# Altium schematic sheet Peripherals_2.SchDoc: PCB_Personal_Gif
size A4; DrawnBy: Ravi kumar dusi; SheetNumber: 3; SheetTotal: 4
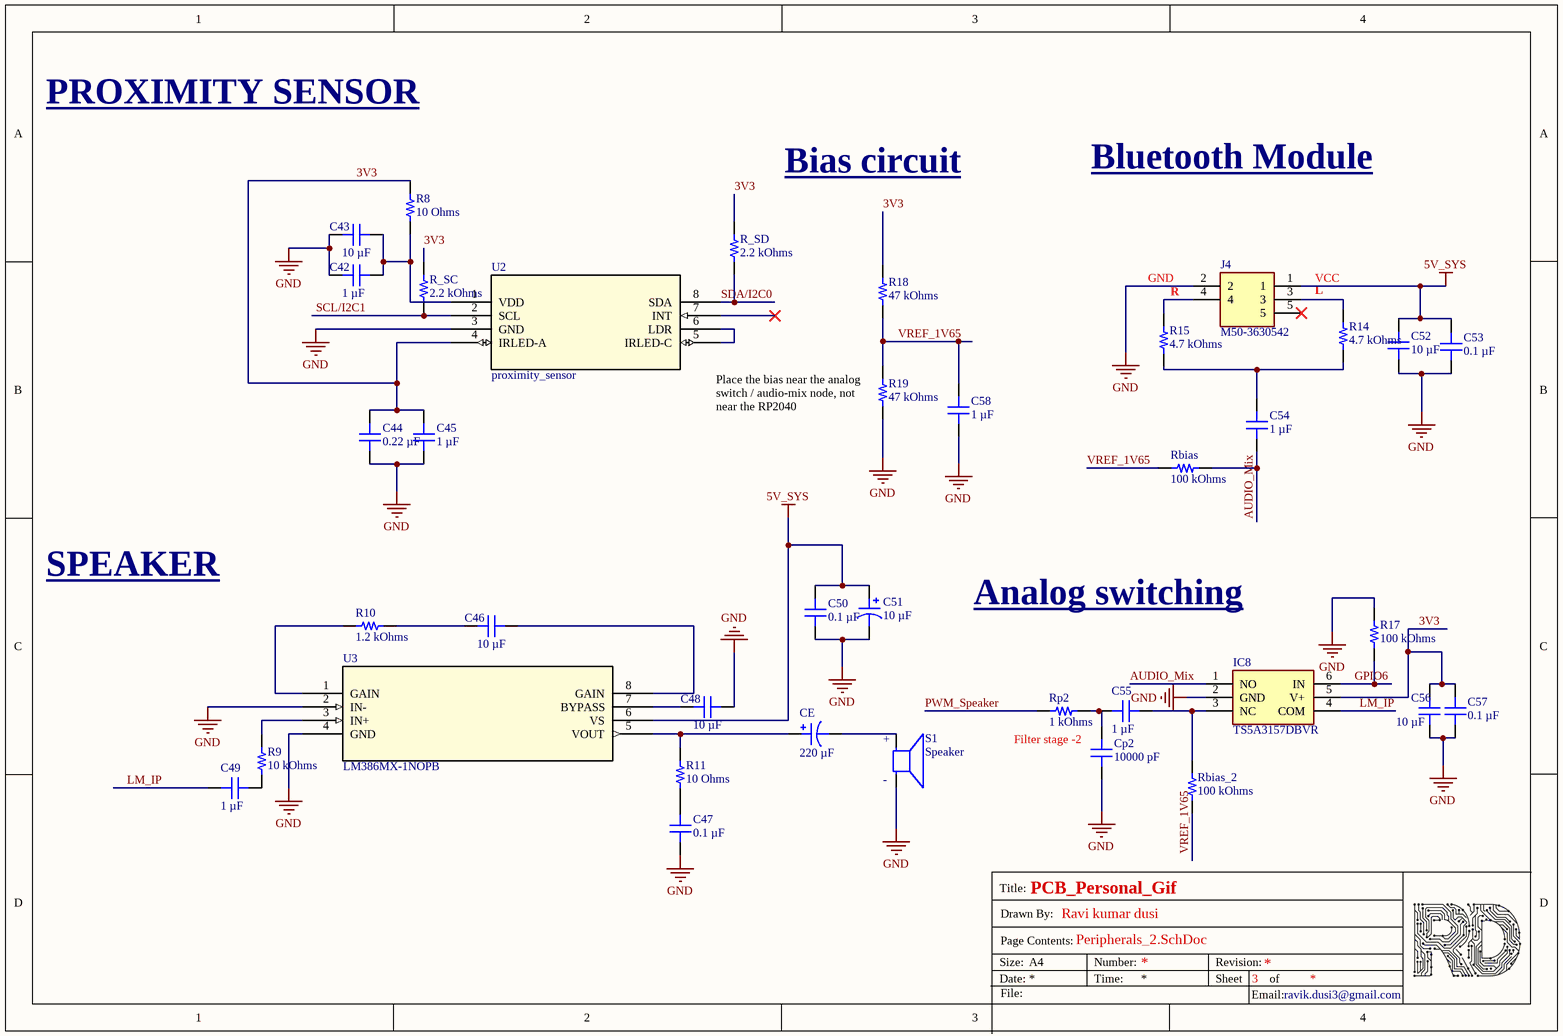
[diagram p0: Peripherals_2.SchDoc]

## Parts
C42  1 µF  [CAP 0402_1005]
C43  10 µF  [CAP 0402_1005]
C44  0.22 µF  [CAP 0402_1005]
C45  1 µF  [CAP 0402_1005]
C46  10 µF  [CAP 0402_1005]
C47  0.1 µF  [CAP 0402_1005]
C48  10 µF  [CAP 0402_1005]
C49  1 µF  [MURATA GRM155 0402_1005]
C50  0.1 µF  [CAP 0402_1005]
C51  10 µF  [CAP ALSMD 4.3MM H5.4MM]
C52  10 µF  [CAP 0402_1005]
C53  0.1 µF  [CAP 0402_1005]
C54  1 µF  [MURATA GRM155 0402_1005]
C55  1 µF  [MURATA GRM155 0402_1005]
C56  10 µF  [CAP 0402_1005]
C57  0.1 µF  [CAP 0402_1005]
C58  1 µF  [MURATA GRM155 0402_1005]
CE  220 µF  [CAP ALSMD 8.3MM H10.5MM]
Cp2  10000 pF  [CAP 0402_1005]
IC8  TS5A3157DBVR  [SOT95P280X145-6N]
J4  M50-3630542  [M503630542]
R8  10 Ohms  [RES 0402_1005]
R9  10 kOhms  [RES 0402_1005]
R10  1.2 kOhms  [RES 0402_1005]
R11  10 Ohms  [RES 0402_1005]
R14  4.7 kOhms  [YAGEO RES 0402_1005]
R15  4.7 kOhms  [YAGEO RES 0402_1005]
R17  100 kOhms  [RES 0402_1005]
R18  47 kOhms  [YAGEO RES 0402_1005]
R19  47 kOhms  [YAGEO RES 0402_1005]
R_SC  2.2 kOhms  [RES 0402_1005]
R_SD  2.2 kOhms  [RES 0402_1005]
Rbias  100 kOhms  [RES 0402_1005]
Rbias_2  100 kOhms  [RES 0402_1005]
Rp2  1 kOhms  [YAGEO RES 0402_1005]
S1  Speaker  [SPKR_AS01508MS-SC11-WP-R]
U2  proximity_sensor  [SMT_X01-GS08_VIS]
U3  LM386MX-1NOPB  [M08A_TEX]

## Nets
5V_SYS: C50.2 C51.1 C52.2 C53.2 J4.1 U3.6(VS)
GND: C42.2 C43.1 C44.1 C45.2 C47.1 C48.2 C50.1 C51.2 C52.1 C53.1 C56.1 C57.1 C58.1 Cp2.1 IC8.2(GND) J4.2 R17.2 R19.1 S1.N(NEG) U2.3(GND) U3.2(IN-) U3.4(GND)
3V3: C44.2 C45.1 C56.2 C57.2 IC8.5(V+) R8.2 R18.2 R_SC.2 R_SD.2 U2.4(IRLED-A)
AUDIO_Mix: C54.1 IC8.1(NO) Rbias.2
GPIO6: IC8.6(IN) R17.1
LM_IP: C49.1 IC8.4(COM)
PWM_Speaker: Rp2.1
SCL/I2C1: R_SC.1 U2.2(SCL)
SDA/I2C0: R_SD.1 U2.8(SDA)
VREF_1V65: C58.2 R18.1 R19.2 Rbias.1 Rbias_2.1
NetC42_1: C42.1 C43.2 R8.1 U2.1(VDD)
NetC46_1: C46.1 R10.2
NetC46_2: C46.2 U3.8(GAIN)
NetC47_2: C47.2 R11.1
NetC48_1: C48.1 U3.7(BYPASS)
NetC49_2: C49.2 R9.1
NetC54_2: C54.2 R14.1 R15.1
NetC55_1: C55.1 Cp2.2 Rp2.2
NetC55_2: C55.2 IC8.3(NC) Rbias_2.2
NetCE_1: CE.1 R11.2 U3.5(VOUT)
NetCE_2: CE.2 S1.P(POS)
NetJ4_3: J4.3 R14.2
NetJ4_4: J4.4 R15.2
NetR9_2: R9.2 U3.3(IN+)
NetR10_1: R10.1 U3.1(GAIN)
NetU2_5: U2.5(IRLED-C) U2.6(LDR)

Not connected (* = marked no-connect by the designer): J4 5*; U2 7(INT)*

## Notes on the sheet
- PROXIMITY SENSOR
- Bias circuit
- Bluetooth Module
- GND
- R
- VCC
- L
- (near R19) Place the bias near the analog switch / audio-mix node, not near the RP2040
- SPEAKER
- Analog switching
- (near Cp2) Filter stage -2
- Title:
- Drawn By:
- Size:
- Date:
- File:
- Page Contents:
- A4
- Number:
- Time:
- Revision:
- Sheet
- Email:
- of
- ravik.dusi3@gmail.com
- (in symbol Speaker) +; -

## Library data of the parts
C42 C45 C49 C54 C55 C58 = GRM155C71A105KE11D: CAP CER 1UF 10V X7S 0402; manufacturer: Murata Electronics; Tolerance: ±10%; Part Number: GRM155C71A105KE11D; Applications: General Purpose; Capacitance: 1 µF; componentlink1description: Datasheet; componentlink1url: https://search.murata.co.jp/Ceramy/image/img/A01X/G101/ENG/GRM155C71A105KE11-01.pdf; componentlink2description: DigiKey Link; componentlink2url: https://www.digikey.com/en/products/detail/murata-electronics/GRM155C71A105KE11D/6606086; Device Package: 0402 (1005 Metric); Lifecycle Status: Active; Minimum Order: 1; Mounting Type: Surface Mount, MLCC; Operating Temperature: -55°C ~ 125°C; Package / Case: 0402 (1005 Metric); packaging: TapeAndReel; partid: 1749; Part Status: Active; price: 0.01; series: GRM; Size / Dimension: 0.039" L x 0.020" W (1.00mm x 0.50mm); Supplier 1: DigiKey; Supplier Part Number 1: 490-14457-1-ND; Temperature Coefficient: X7S; Thickness (Max): 0.024" (0.60mm); Voltage - Rated: 10V
  C42 C45: Value: 1 µF; lastupdated: 09/02/2024 20:04:38
  C49 C54 C55 C58: lastupdated: 23-07-2025 10:42:36; value: 1 µF
C43 C46 C48 C52 C56 = CL05A106MP8NUB8: CAP CER 10UF 10V X5R 0402; manufacturer: Samsung Electro-Mechanics; Tolerance: ±20%; Part Number: CL05A106MP8NUB8; Applications: Acoustic Noise Reduction; Capacitance: 10 µF; componentlink1description: Datasheet; componentlink1url: http://www.samsungsem.com/kr/support/product-search/mlcc/CL05A106MP8NUB8.jsp; componentlink2description: DigiKey Link; componentlink2url: https://www.digikey.com/en/products/detail/samsung-electro-mechanics/CL05A106MP8NUB8/5961314; Device Package: 0402 (1005 Metric); Lifecycle Status: Active; Minimum Order: 1; Mounting Type: Surface Mount, MLCC; Operating Temperature: -55°C ~ 85°C; Package / Case: 0402 (1005 Metric); packaging: TapeAndReel; partid: 1758; Part Status: Active; price: 0.06; series: CL; Size / Dimension: 0.039" L x 0.020" W (1.00mm x 0.50mm); Supplier 1: DigiKey; Supplier Part Number 1: 1276-6830-1-ND; Temperature Coefficient: X5R; Thickness (Max): 0.035" (0.90mm); Voltage - Rated: 10V
  C43 C46 C48: Value: 10 µF; lastupdated: 09/02/2024 20:04:38
  C52 C56: lastupdated: 09-02-2024 20:04:38; value: 10 µF
C44 = GRM155R71C224KA12D: CAP CER 0.22UF 16V X7R 0402; manufacturer: Murata Electronics; Tolerance: ±10%; Part Number: GRM155R71C224KA12D; Value: 0.22 µF; Applications: General Purpose; Capacitance: 0.22 µF; componentlink1description: Datasheet; componentlink1url: https://www.murata.com/~/media/webrenewal/support/library/catalog/products/capacitor/mlcc/c02e.ashx?la=en-us; componentlink2description: DigiKey Link; componentlink2url: https://www.digikey.com/en/products/detail/murata-electronics/GRM155R71C224KA12D/2175204; Device Package: 0402 (1005 Metric); lastupdated: 09/02/2024 20:04:37; Lifecycle Status: Active; Minimum Order: 1; Mounting Type: Surface Mount, MLCC; Operating Temperature: -55°C ~ 125°C; Package / Case: 0402 (1005 Metric); packaging: TapeAndReel; partid: 2082; Part Status: Active; price: 0.01; series: GRM; Size / Dimension: 0.039" L x 0.020" W (1.00mm x 0.50mm); Supplier 1: DigiKey; Supplier Part Number 1: 490-5418-1-ND; Temperature Coefficient: X7R; Thickness (Max): 0.022" (0.55mm); Voltage - Rated: 16V
C47 C50 C53 C57 = C0402C104K4RECAUTO: CAP CER 0402 0.1UF 16V X7R 10%; manufacturer: KEMET; Part Number: C0402C104K4RECAUTO; Applications: Automotive, ESD Protection; Capacitance: 0.1 µF; componentlink1description: Datasheet; componentlink1url: https://api.kemet.com/component-edge/download/datasheet/C0402C104K4RECAUTO.pdf; componentlink2description: DigiKey Link; componentlink2url: https://www.digikey.com/en/products/detail/kemet/C0402C104K4RECAUTO/8563695; Device Package: 0402 (1005 Metric); Lifecycle Status: Active; Minimum Order: 1; Mounting Type: Surface Mount, MLCC; Operating Temperature: -55°C ~ 125°C; Package / Case: 0402 (1005 Metric); packaging: TapeAndReel; partid: 1731; Part Status: Active; price: 0.01; Ratings: AEC-Q200; series: ESD SMD Auto X7R; Size / Dimension: 0.039" L x 0.020" W (1.00mm x 0.50mm); Supplier 1: DigiKey; Supplier Part Number 1: 399-17167-1-ND; Temperature Coefficient: X7R; Thickness (Max): 0.022" (0.55mm); Tolerance: ±10%; Voltage - Rated: 16V
  C47 C50: Value: 0.1 µF; lastupdated: 09/02/2024 20:04:38
  C53 C57: lastupdated: 09-02-2024 20:04:38; value: 0.1 µF
C51 = UWX1C100MCL1GB: CAP ALUM 10UF 20% 16V SMD; manufacturer: Nichicon; Lifetime @ Temp.: 2000 Hrs @ 85°C; Polarization: Polar; Ripple Current @ High Frequency: 34.5 mA @ 10 kHz; Ripple Current @ Low Frequency: 23 mA @ 120 Hz; Surface Mount Land Size: 0.169" L x 0.169" W (4.30mm x 4.30mm); Part Number: UWX1C100MCL1GB; Applications: General Purpose; Capacitance: 10 µF; componentlink1description: Datasheet; componentlink1url: https://products.nichicon.co.jp/en/pdf/XJA043/e-uwx.pdf; componentlink2description: DigiKey Link; componentlink2url: https://www.digikey.com/en/products/detail/nichicon/UWX1C100MCL1GB/589841; Device Package: Radial, Can - SMD; Height - Seated (Max): 0.213" (5.40mm); lastupdated: 03/06/2024 19:53:00; Lifecycle Status: Active; Minimum Order: 1; Mounting Type: Surface Mount; Operating Temperature: -40°C ~ 85°C; Package / Case: Radial, Can - SMD; packaging: TapeAndReel; partid: 7030; Part Status: Active; price: 0.06; series: UWX; Size / Dimension: 0.157" Dia (4.00mm); Supplier 1: DigiKey; Supplier Part Number 1: 493-2100-1-ND; Tolerance: ±20%; value: 10 µF; Voltage - Rated: 16 V
CE = EEE-FK1V221P: CAP ALUM 220UF 20% 35V SMD; manufacturer: Panasonic Electronic Components; Impedance: 160 mOhms; Lifetime @ Temp.: 2000 Hrs @ 105°C; Polarization: Polar; Ripple Current @ High Frequency: 600 mA @ 100 kHz; Ripple Current @ Low Frequency: 450 mA @ 120 Hz; Surface Mount Land Size: 0.327" L x 0.327" W (8.30mm x 8.30mm); Part Number: EEE-FK1V221P; Applications: Automotive; Capacitance: 220 µF; componentlink1description: Datasheet; componentlink1url: http://industrial.panasonic.com/www-cgi/jvcr13pz.cgi?E+PZ+3+ABA0120+EEEFK1V221P+7+WW; componentlink2description: DigiKey Link; componentlink2url: https://www.digikey.com/en/products/detail/panasonic-electronic-components/EEE-FK1V221P/766007; Device Package: Radial, Can - SMD; Height - Seated (Max): 0.413" (10.50mm); lastupdated: 03-06-2024 20:15:49; Lifecycle Status: Active; Minimum Order: 1; Mounting Type: Surface Mount; Operating Temperature: -55°C ~ 105°C; Package / Case: Radial, Can - SMD; packaging: TapeAndReel; partid: 7483; Part Status: Active; price: 0.20; Ratings: AEC-Q200; series: FK; Size / Dimension: 0.315" Dia (8.00mm); Supplier 1: DigiKey; Supplier Part Number 1: PCE3839CT-ND; Tolerance: ±20%; value: 220 µF; Voltage - Rated: 35 V
Cp2 = C0402C103M5RECAUTO: CAP CER 0402 10NF 50V X7R 20%; manufacturer: KEMET; Part Number: C0402C103M5RECAUTO; Capacitance: 10000 pF; Applications: Automotive, ESD Protection; componentlink1description: Datasheet; componentlink1url: https://api.kemet.com/component-edge/download/datasheet/C0402C103M5RECAUTO.pdf; componentlink2description: DigiKey Link; componentlink2url: https://www.digikey.com/en/products/detail/kemet/C0402C103M5RECAUTO/8646509; Device Package: 0402 (1005 Metric); lastupdated: 09-02-2024 20:04:13; Lifecycle Status: Active; Minimum Order: 1; Mounting Type: Surface Mount, MLCC; Operating Temperature: -55°C ~ 125°C; Package / Case: 0402 (1005 Metric); packaging: TapeAndReel; partid: 33125; Part Status: Active; price: 0.01; Ratings: AEC-Q200; series: ESD SMD Auto X7R; Size / Dimension: 0.039" L x 0.020" W (1.00mm x 0.50mm); Supplier 1: DigiKey; Supplier Part Number 1: 399-C0402C103M5RECAUTOCT-ND; Temperature Coefficient: X7R; Thickness (Max): 0.022" (0.55mm); Tolerance: ±20%; value: 10000 pF; Voltage - Rated: 50V
IC8 = TS5A3157DBVR: Integrated Circuit; Manufacturer_Name: Texas Instruments; Datasheet Link: http://www.ti.com/general/docs/lit/getliterature.tsp?genericPartNumber=ts5a3157&fileType=pdf; Height: 1.45mm; Manufacturer_Part_Number: TS5A3157DBVR; Mouser Part Number: 595-TS5A3157DBVR; Mouser Price/Stock: https://www.mouser.co.uk/ProductDetail/Texas-Instruments/TS5A3157DBVR?qs=0O%2FZFlpUpJUE%2F9RUWXxdeQ%3D%3D; Arrow Part Number: TS5A3157DBVR; Arrow Price/Stock: https://www.arrow.com/en/products/ts5a3157dbvr/texas-instruments?utm_currency=USD&region=nac
J4 = M50-3630542: Connector; Manufacturer_Name: Harwin; Datasheet Link: https://content.harwin.com/m/6cdc14cba4152813/original/DRG-02647-Technical-Drawing-Datasheet-M50-363-pdf.pdf; Height: 4.5mm; Manufacturer_Part_Number: M50-3630542; Mouser Part Number: 855-M50-3630542; Mouser Price/Stock: https://www.mouser.co.uk/ProductDetail/Harwin/M50-3630542?qs=%252BdQmOuGyFcGTcknJK14WpQ%3D%3D
R8 R11 = ERA-2AKD100X: RES SMD 10 OHM 0.5% 1/16W 0402; Manufacturer: Panasonic Electronic Components; Power (Watts): 0.063W, 1/16W; Temperature Coefficient: ±100ppm/°C; Part Number: ERA-2AKD100X; Value: 10 Ohms; ComponentLink1Description: Datasheet; ComponentLink1URL: https://industrial.panasonic.com/cdbs/www-data/pdf/RDM0000/AOA0000C307.pdf; ComponentLink2Description: DigiKey Link; ComponentLink2URL: https://www.digikey.com/en/products/detail/panasonic-electronic-components/ERA-2AKD100X/1706054; Composition: Thin Film; Device Package: 0402 (1005 Metric); Features: Automotive AEC-Q200; Height - Seated (Max): 0.016" (0.40mm); LastUpdated: 09/02/2024 20:30:21; Lifecycle Status: Active; Minimum Order: 1; Number of Terminations: 2; Operating Temperature: -55°C ~ 155°C; Package / Case: 0402 (1005 Metric); Packaging: TapeAndReel; PartId: 3168; Part Status: Active; Price: 0.02; Ratings: AEC-Q200; Resistance: 10 Ohms; Series: ERA-2A; Size / Dimension: 0.039" L x 0.020" W (1.00mm x 0.50mm); Supplier 1: DigiKey; Supplier Part Number 1: P10DDCT-ND; Supplier Device Package: 0402; Tolerance: ±0.5%
R9 = AC0402JR-0710KL: RES SMD 10K OHM 5% 1/16W 0402; Manufacturer: Yageo; Power (Watts): 0.063W, 1/16W; Temperature Coefficient: ±100ppm/°C; Part Number: AC0402JR-0710KL; Value: 10 kOhms; ComponentLink1Description: Datasheet; ComponentLink1URL: https://www.yageo.com/upload/media/product/productsearch/datasheet/rchip/PYu-AC_51_RoHS_L_7.pdf; ComponentLink2Description: DigiKey Link; ComponentLink2URL: https://www.digikey.com/en/products/detail/yageo/AC0402JR-0710KL/5895571; Composition: Thick Film; Device Package: 0402 (1005 Metric); Features: Automotive AEC-Q200, Moisture Resistant; Height - Seated (Max): 0.015" (0.37mm); LastUpdated: 09/02/2024 20:30:20; Lifecycle Status: Active; Minimum Order: 1; Number of Terminations: 2; Operating Temperature: -55°C ~ 155°C; Package / Case: 0402 (1005 Metric); Packaging: CutTape; PartId: 3376; Part Status: Active; Price: 0.01; Ratings: AEC-Q200; Resistance: 10 kOhms; Series: AC; Size / Dimension: 0.039" L x 0.020" W (1.00mm x 0.50mm); Supplier 1: DigiKey; Supplier Part Number 1: YAG3517CT-ND; Supplier Device Package: 0402; Tolerance: ±5%
R10 = RR0510P-122-D: RES SMD 1.2K OHM 0.5% 1/16W 0402; Manufacturer: Susumu; Power (Watts): 0.063W, 1/16W; Temperature Coefficient: ±25ppm/°C; Part Number: RR0510P-122-D; Value: 1.2 kOhms; ComponentLink1Description: Datasheet; ComponentLink1URL: http://www.susumu.co.jp/common/pdf/n_catalog_partition05_en.pdf; ComponentLink2Description: DigiKey Link; ComponentLink2URL: https://www.digikey.com/en/products/detail/susumu/RR0510P-122-D/432399; Composition: Thin Film; Device Package: 0402 (1005 Metric); Height - Seated (Max): 0.016" (0.40mm); LastUpdated: 09/02/2024 20:30:21; Lifecycle Status: Active; Minimum Order: 1; Number of Terminations: 2; Operating Temperature: -55°C ~ 125°C; Package / Case: 0402 (1005 Metric); Packaging: TapeAndReel; PartId: 3223; Part Status: Active; Price: 0.01; Resistance: 1.2 kOhms; Series: RR; Size / Dimension: 0.039" L x 0.020" W (1.00mm x 0.50mm); Supplier 1: DigiKey; Supplier Part Number 1: RR05P1.2KDCT-ND; Tolerance: ±0.5%
R14 R15 = RT0402FRE074K7L: RES SMD 4.7K OHM 1% 1/16W 0402; Manufacturer: Yageo; Power (Watts): 0.063W, 1/16W; Temperature Coefficient: ±50ppm/°C; Part Number: RT0402FRE074K7L; Value: 4.7 kOhms; ComponentLink1Description: Datasheet; ComponentLink1URL: https://www.yageo.com/upload/media/product/productsearch/datasheet/rchip/PYu-RT_1-to-0.01_RoHS_L_11.pdf; ComponentLink2Description: DigiKey Link; ComponentLink2URL: https://www.digikey.com/en/products/detail/yageo/RT0402FRE074K7L/1072052; Composition: Thin Film; Device Package: 0402 (1005 Metric); Height - Seated (Max): 0.014" (0.35mm); LastUpdated: 31-08-2025 15:04:17; Lifecycle Status: Active; Minimum Order: 1; Number of Terminations: 2; Operating Temperature: -55°C ~ 155°C; Package / Case: 0402 (1005 Metric); Packaging: TapeAndReel; PartId: 3198; Part Status: Active; Price: 0.01; Resistance: 4.7 kOhms; Series: RT; Size / Dimension: 0.039" L x 0.020" W (1.00mm x 0.50mm); Supplier 1: DigiKey; Supplier Part Number 1: YAG3347CT-ND; Supplier Device Package: 0402; Tolerance: ±1%
R17 Rbias Rbias_2 = RP73PF1E100KBTD: RES 100K OHM 0.1% 1/10W 0402; Manufacturer: TE Connectivity Passive Product; Power (Watts): 0.1W, 1/10W; Temperature Coefficient: ±25ppm/°C; Part Number: RP73PF1E100KBTD; Value: 100 kOhms; ComponentLink1Description: Datasheet; ComponentLink1URL: https://www.te.com/commerce/DocumentDelivery/DDEController?Action=srchrtrv&DocNm=1773272&DocType=DS&DocLang=English; ComponentLink2Description: DigiKey Link; ComponentLink2URL: https://www.digikey.com/en/products/detail/te-connectivity-passive-product/RP73PF1E100KBTD/8261053; Composition: Thin Film; Device Package: 0402 (1005 Metric); Height - Seated (Max): 0.014" (0.35mm); LastUpdated: 09-02-2024 20:30:24; Lifecycle Status: Active; Minimum Order: 1; Number of Terminations: 2; Operating Temperature: -55°C ~ 155°C; Package / Case: 0402 (1005 Metric); Packaging: TapeAndReel; PartId: 2436; Part Status: Active; Price: 0.08; Resistance: 100 kOhms; Series: RP73, Holsworthy; Size / Dimension: 0.039" L x 0.020" W (1.00mm x 0.50mm); Supplier 1: DigiKey; Supplier Part Number 1: A127511CT-ND; Supplier Device Package: 0402; Tolerance: ±0.1%
R18 R19 = AC0402JR-0747KL: RES SMD 47K OHM 5% 1/16W 0402; Manufacturer: Yageo; Power (Watts): 0.063W, 1/16W; Temperature Coefficient: ±100ppm/°C; Part Number: AC0402JR-0747KL; Value: 47 kOhms; ComponentLink1Description: Datasheet; ComponentLink1URL: https://www.yageo.com/upload/media/product/productsearch/datasheet/rchip/PYu-AC_51_RoHS_L_7.pdf; ComponentLink2Description: DigiKey Link; ComponentLink2URL: https://www.digikey.com/en/products/detail/yageo/AC0402JR-0747KL/5895679; Composition: Thick Film; Device Package: 0402 (1005 Metric); Features: Automotive AEC-Q200, Moisture Resistant; Height - Seated (Max): 0.015" (0.37mm); LastUpdated: 31-08-2025 15:04:17; Lifecycle Status: Active; Minimum Order: 1; Number of Terminations: 2; Operating Temperature: -55°C ~ 155°C; Package / Case: 0402 (1005 Metric); Packaging: CutTape; PartId: 3385; Part Status: Active; Price: 0.01; Ratings: AEC-Q200; Resistance: 47 kOhms; Series: AC; Size / Dimension: 0.039" L x 0.020" W (1.00mm x 0.50mm); Supplier 1: DigiKey; Supplier Part Number 1: YAG3547CT-ND; Supplier Device Package: 0402; Tolerance: ±5%
R_SC R_SD = TNPW04022K20BYEP: RES 2.2K OHM 0.1% 1/16W 0402; Manufacturer: Vishay Dale; Power (Watts): 0.063W, 1/16W; Temperature Coefficient: ±10ppm/°C; Part Number: TNPW04022K20BYEP; Value: 2.2 kOhms; ComponentLink1Description: Datasheet; ComponentLink1URL: http://www.vishay.com/docs/28758/tnpw_e3.pdf; ComponentLink2Description: DigiKey Link; ComponentLink2URL: https://www.digikey.com/en/products/detail/vishay-dale/TNPW04022K20BYEP/8636618; Composition: Thin Film; Device Package: 0402 (1005 Metric); Features: Anti-Sulfur, Automotive AEC-Q200, Moisture Resistant; Height - Seated (Max): 0.016" (0.40mm); LastUpdated: 09-02-2024 20:30:21; Lifecycle Status: Active; Minimum Order: 1; Number of Terminations: 2; Operating Temperature: -55°C ~ 155°C; Package / Case: 0402 (1005 Metric); Packaging: TapeAndReel; PartId: 3077; Part Status: Active; Price: 0.25; Ratings: AEC-Q200; Resistance: 2.2 kOhms; Series: TNPW e3; Size / Dimension: 0.039" L x 0.020" W (1.00mm x 0.50mm); Supplier 1: DigiKey; Supplier Part Number 1: 541-9805-1-ND; Supplier Device Package: 0402; Tolerance: ±0.1%
Rp2 = AT0402BRD071KL: RES SMD 1K OHM 0.1% 1/16W 0402; Manufacturer: Yageo; Power (Watts): 0.063W, 1/16W; Temperature Coefficient: ±25ppm/°C; Part Number: AT0402BRD071KL; Value: 1 kOhms; ComponentLink1Description: Datasheet; ComponentLink1URL: http://www.yageo.com/documents/recent/PYu-AT_51_RoHS_L_5.pdf; ComponentLink2Description: DigiKey Link; ComponentLink2URL: https://www.digikey.com/en/products/detail/yageo/AT0402BRD071KL/5138607; Composition: Thin Film; Device Package: 0402 (1005 Metric); Features: Anti-Sulfur, Automotive AEC-Q200, Moisture Resistant; Height - Seated (Max): 0.014" (0.35mm); LastUpdated: 31-08-2025 15:04:18; Lifecycle Status: Active; Minimum Order: 1; Number of Terminations: 2; Operating Temperature: -55°C ~ 155°C; Package / Case: 0402 (1005 Metric); Packaging: TapeAndReel; PartId: 2462; Part Status: Active; Price: 0.09; Ratings: AEC-Q200; Resistance: 1 kOhms; Series: AT; Size / Dimension: 0.039" L x 0.020" W (1.00mm x 0.50mm); Supplier 1: DigiKey; Supplier Part Number 1: YAG2088CT-ND; Supplier Device Package: 0402; Tolerance: ±0.1%
S1 = Speaker: AS01508MS-SC11-WP-R speaker,0.7 INPUT PWR, 60-20K dB frequency.
U2 = proximity_sensor: Proximity Sensors INTEGRATED PROXIMITY + IR LED.
U3 = LM386MX-1NOPB: IC AMP CLASS AB MONO 325MW 8SOIC.AUDIO AMPLIFIER; Mfr_Name: Texas Instruments; RefDes: RefDes; Type: Type